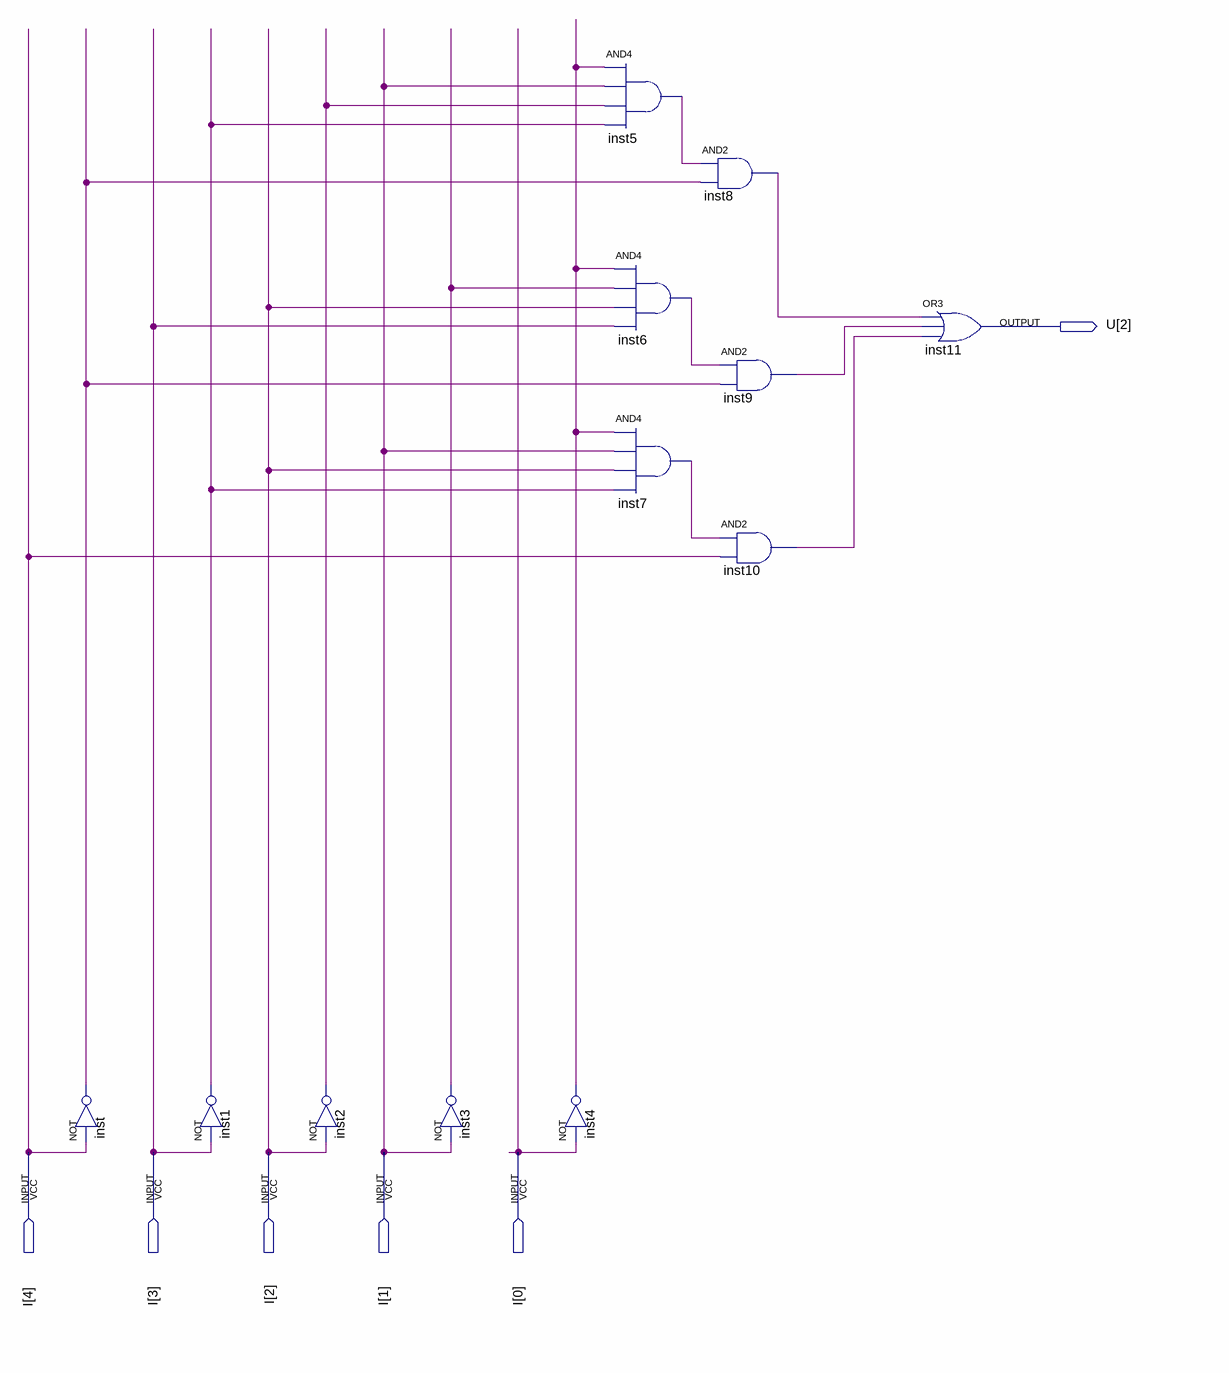
[diagram p0: schematic sheet]
// Quartus schematic BCD_c_Segment.bdf as structural Verilog: 12 symbols, 6 pins
module BCD_c_Segment (
  input  [4:0] I,
  output [2:2] U
);

  wire inst1_out, inst2_out, inst3_out, inst4_out, inst5_out, inst6_out, inst7_out, inst8_out, inst9_out,
       inst10_out, inst_out;

  not inst (inst_out, I[4]);
  not inst1 (inst1_out, I[3]);
  not inst2 (inst2_out, I[2]);
  not inst3 (inst3_out, I[1]);
  and inst5 (inst5_out, inst4_out, I[1], inst2_out, inst1_out);
  and inst6 (inst6_out, inst4_out, inst3_out, I[2], I[3]);
  and inst7 (inst7_out, inst4_out, I[1], I[2], inst1_out);
  not inst4 (inst4_out, I[0]);
  and inst8 (inst8_out, inst5_out, inst_out);
  and inst9 (inst9_out, inst6_out, inst_out);
  and inst10 (inst10_out, inst7_out, I[4]);
  or inst11 (U[2], inst8_out, inst9_out, inst10_out);
endmodule
